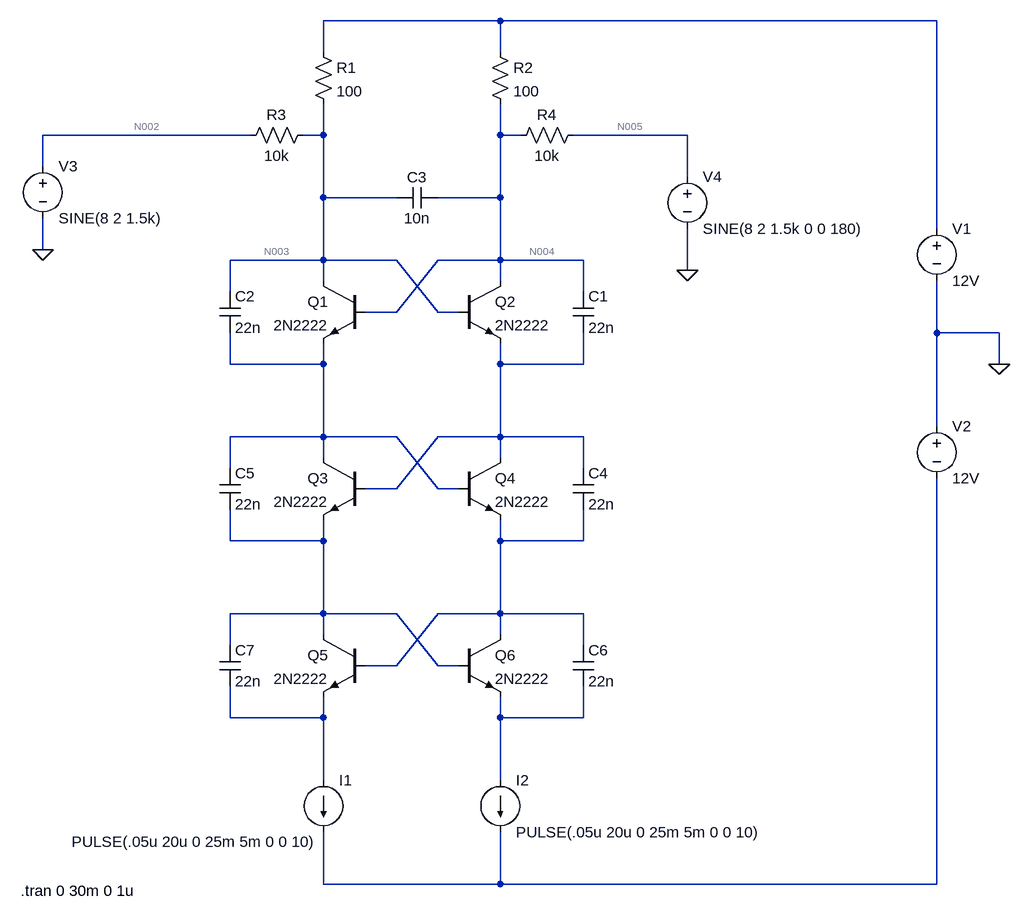
[diagram p0: schematic arp_quadra_phaser.asc]
arp_quadra_phaser.asc, the LTspice schematic file:
Version 4
SHEET 1 1156 1052
WIRE 368 -304 96 -304
WIRE 1040 -304 368 -304
WIRE 96 -256 96 -304
WIRE 368 -256 368 -304
WIRE -16 -128 -336 -128
WIRE 96 -128 96 -176
WIRE 96 -128 64 -128
WIRE 368 -128 368 -176
WIRE 400 -128 368 -128
WIRE 656 -128 480 -128
WIRE -336 -80 -336 -128
WIRE 656 -64 656 -128
WIRE 96 -32 96 -128
WIRE 208 -32 96 -32
WIRE 368 -32 368 -128
WIRE 368 -32 272 -32
WIRE 1040 16 1040 -304
WIRE -336 48 -336 0
WIRE 96 64 96 -32
WIRE 96 64 -48 64
WIRE 208 64 96 64
WIRE 368 64 368 -32
WIRE 368 64 272 64
WIRE 496 64 368 64
WIRE 656 80 656 16
WIRE 96 96 96 64
WIRE 368 96 368 64
WIRE -48 112 -48 64
WIRE 496 112 496 64
WIRE 208 144 272 64
WIRE 208 144 160 144
WIRE 272 144 208 64
WIRE 304 144 272 144
WIRE 1040 176 1040 96
WIRE 1136 176 1040 176
WIRE -48 224 -48 176
WIRE 96 224 96 192
WIRE 96 224 -48 224
WIRE 368 224 368 192
WIRE 496 224 496 176
WIRE 496 224 368 224
WIRE 1136 224 1136 176
WIRE 1040 320 1040 176
WIRE 96 336 96 224
WIRE 96 336 -48 336
WIRE 208 336 96 336
WIRE 368 336 368 224
WIRE 368 336 272 336
WIRE 496 336 368 336
WIRE 96 368 96 336
WIRE 368 368 368 336
WIRE -48 384 -48 336
WIRE 496 384 496 336
WIRE 208 416 272 336
WIRE 208 416 160 416
WIRE 272 416 208 336
WIRE 304 416 272 416
WIRE -48 496 -48 448
WIRE 96 496 96 464
WIRE 96 496 -48 496
WIRE 368 496 368 464
WIRE 496 496 496 448
WIRE 496 496 368 496
WIRE 96 608 96 496
WIRE 96 608 -48 608
WIRE 208 608 96 608
WIRE 368 608 368 496
WIRE 368 608 272 608
WIRE 496 608 368 608
WIRE 96 640 96 608
WIRE 368 640 368 608
WIRE -48 656 -48 608
WIRE 496 656 496 608
WIRE 208 688 272 608
WIRE 208 688 160 688
WIRE 272 688 208 608
WIRE 304 688 272 688
WIRE -48 768 -48 720
WIRE 96 768 96 736
WIRE 96 768 -48 768
WIRE 368 768 368 736
WIRE 496 768 496 720
WIRE 496 768 368 768
WIRE 96 864 96 768
WIRE 368 864 368 768
WIRE 96 1024 96 944
WIRE 368 1024 368 944
WIRE 368 1024 96 1024
WIRE 1040 1024 1040 400
WIRE 1040 1024 368 1024
FLAG 1136 224 0
FLAG -336 48 0
FLAG 656 80 0
SYMBOL npn2 160 96 M0
SYMATTR InstName Q1
SYMATTR Value 2N2222
SYMBOL npn2 304 96 R0
SYMATTR InstName Q2
SYMATTR Value 2N2222
SYMBOL res 80 -272 R0
SYMATTR InstName R1
SYMATTR Value 100
SYMBOL res 352 -272 R0
SYMATTR InstName R2
SYMATTR Value 100
SYMBOL cap 480 112 R0
SYMATTR InstName C1
SYMATTR Value 22n
SYMBOL cap -64 112 R0
SYMATTR InstName C2
SYMATTR Value 22n
SYMBOL cap 272 -48 R90
WINDOW 0 0 32 VBottom 2
WINDOW 3 32 32 VTop 2
SYMATTR InstName C3
SYMATTR Value 10n
SYMBOL voltage 1040 0 R0
WINDOW 123 0 0 Left 0
WINDOW 39 0 0 Left 0
SYMATTR InstName V1
SYMATTR Value 12V
SYMBOL voltage 1040 304 R0
WINDOW 123 0 0 Left 0
WINDOW 39 0 0 Left 0
SYMATTR InstName V2
SYMATTR Value 12V
SYMBOL current 96 864 R0
WINDOW 3 -388 95 Left 2
WINDOW 123 0 0 Left 0
WINDOW 39 0 0 Left 0
SYMATTR InstName I1
SYMATTR Value PULSE(.05u 20u 0 25m 5m 0 0 10)
SYMBOL voltage -336 -96 R0
WINDOW 123 0 0 Left 0
WINDOW 39 0 0 Left 0
SYMATTR InstName V3
SYMATTR Value SINE(8 2 1.5k)
SYMBOL res 80 -144 R90
WINDOW 0 0 56 VBottom 2
WINDOW 3 32 56 VTop 2
SYMATTR InstName R3
SYMATTR Value 10k
SYMBOL res 496 -144 R90
WINDOW 0 0 56 VBottom 2
WINDOW 3 32 56 VTop 2
SYMATTR InstName R4
SYMATTR Value 10k
SYMBOL voltage 656 -80 R0
WINDOW 123 0 0 Left 0
WINDOW 39 0 0 Left 0
SYMATTR InstName V4
SYMATTR Value SINE(8 2 1.5k 0 0 180)
SYMBOL current 368 864 R0
WINDOW 123 0 0 Left 0
WINDOW 39 0 0 Left 0
SYMATTR InstName I2
SYMATTR Value PULSE(.05u 20u 0 25m 5m 0 0 10)
SYMBOL npn2 160 368 M0
SYMATTR InstName Q3
SYMATTR Value 2N2222
SYMBOL npn2 304 368 R0
SYMATTR InstName Q4
SYMATTR Value 2N2222
SYMBOL cap 480 384 R0
SYMATTR InstName C4
SYMATTR Value 22n
SYMBOL cap -64 384 R0
SYMATTR InstName C5
SYMATTR Value 22n
SYMBOL npn2 160 640 M0
SYMATTR InstName Q5
SYMATTR Value 2N2222
SYMBOL npn2 304 640 R0
SYMATTR InstName Q6
SYMATTR Value 2N2222
SYMBOL cap 480 656 R0
SYMATTR InstName C6
SYMATTR Value 22n
SYMBOL cap -64 656 R0
SYMATTR InstName C7
SYMATTR Value 22n
TEXT -370 1034 Left 2 !.tran 0 30m 0 1u

The netlist it stands for:
* arp_quadra_phaser.asc
Q1 N003 N004 N006 0 2N2222
Q2 N004 N003 N007 0 2N2222
R1 N001 N003 100
R2 N001 N004 100
C1 N004 N007 22n
C2 N003 N006 22n
C3 N004 N003 10n
V1 N001 0 12V
V2 0 N012 12V
I1 N010 N012 PULSE(.05u 20u 0 25m 5m 0 0 10)
V3 N002 0 SINE(8 2 1.5k)
R3 N003 N002 10k
R4 N005 N004 10k
V4 N005 0 SINE(8 2 1.5k 0 0 180)
I2 N011 N012 PULSE(.05u 20u 0 25m 5m 0 0 10)
Q3 N006 N007 N008 0 2N2222
Q4 N007 N006 N009 0 2N2222
C4 N007 N009 22n
C5 N006 N008 22n
Q5 N008 N009 N010 0 2N2222
Q6 N009 N008 N011 0 2N2222
C6 N009 N011 22n
C7 N008 N010 22n
.model NPN NPN
.model PNP PNP
.lib standard.bjt
.tran 0 30m 0 1u
.backanno
.end

* Results of the author's LTspice run, read from the files saved beside the schematic
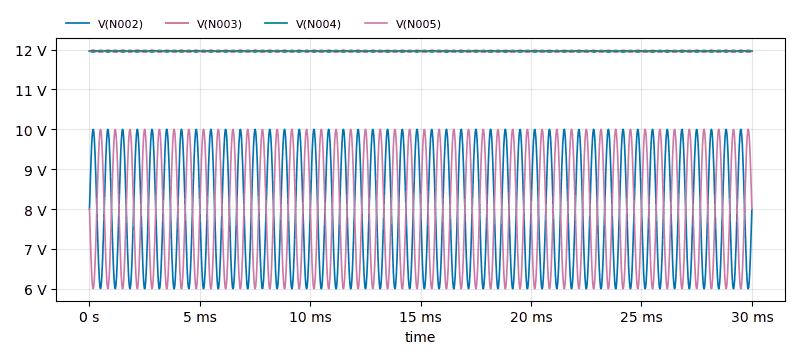
[diagram p1: Transient Analysis of arp_quadra_phaser.asc, plotted from the saved traces]
* Transient Analysis, 1 run:
*   V(N002): min 6 V, max 10 V, average 8 V, rms 8.124 V, last 8 V
*   V(N003): min 11.94 V, max 11.98 V, average 11.96 V, rms 11.96 V, last 11.96 V
*   V(N004): min 11.94 V, max 11.98 V, average 11.96 V, rms 11.96 V, last 11.96 V
*   V(N005): min 6 V, max 10 V, average 8 V, rms 8.124 V, last 8 V